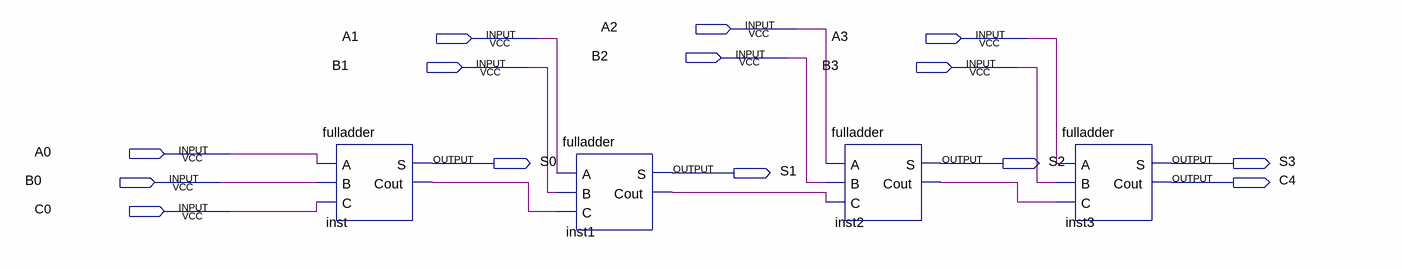
[diagram p0: schematic sheet]
// Quartus schematic rippleCarry.bdf as structural Verilog: 4 symbols, 14 pins
module rippleCarry (
  input  A2,
  input  A1,
  input  A3,
  input  B2,
  input  B1,
  input  B3,
  input  A0,
  input  B0,
  input  C0,
  output S0,
  output S2,
  output S3,
  output S1,
  output C4
);

  wire inst1_cout, inst2_cout, inst_cout;

  fulladder inst (.A(A0), .B(B0), .C(C0), .S(S0), .Cout(inst_cout));
  fulladder inst1 (.A(A1), .B(B1), .C(inst_cout), .S(S1), .Cout(inst1_cout));
  fulladder inst2 (.A(A2), .B(B2), .C(inst1_cout), .S(S2), .Cout(inst2_cout));
  fulladder inst3 (.A(A3), .B(B3), .C(inst2_cout), .S(S3), .Cout(C4));
endmodule
